# EAGLE design sensor (EAGLE 6.3)
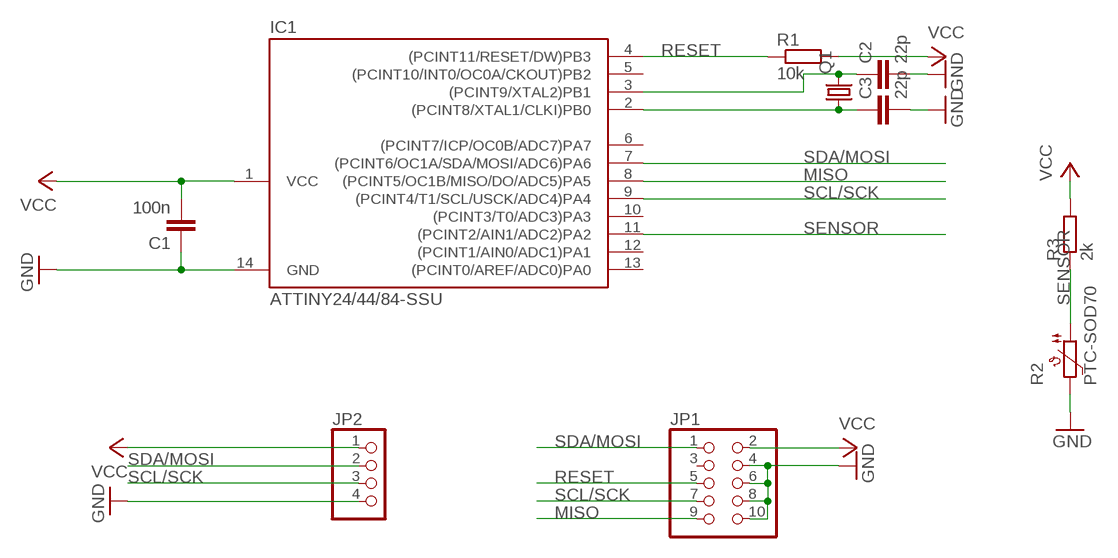
[diagram p0: schematic, sheet 1]

## Parts
C1  100n  C-EUC0805  [C0805]
C2  22p  C-EUC0805  [C0805]
C3  22p  C-EUC0805  [C0805]
IC1  ATTINY24/44/84-SSU  [SOIC14]
JP1  PINHD-2X5  [2X05]
JP2  PINHD-1X4  [1X04]
Q1  CRYSTALHC49UP  [HC49UP]
R1  10k  R-EU_M0805  [M0805]
R2  PTC-SOD70  [SOD70]
R3  2k  R-EU_M0805  [M0805]

## Nets
GND: C1.1 C2.2 C3.2 IC1.14(GND) JP1.4 JP1.6 JP1.8 JP1.10 JP2.4 R2.2
MISO: IC1.8((PCINT5/OC1B/MISO/DO/ADC5)PA5) JP1.9
N$1: C2.1 IC1.3((PCINT9/XTAL2)PB1) Q1.2
N$2: C3.1 IC1.2((PCINT8/XTAL1/CLKI)PB0) Q1.1
RESET: IC1.4((PCINT11/RESET/DW)PB3) JP1.5 R1.1
SCL/SCK: IC1.9((PCINT4/T1/SCL/USCK/ADC4)PA4) JP1.7 JP2.3
SDA/MOSI: IC1.7((PCINT6/OC1A/SDA/MOSI/ADC6)PA6) JP1.1 JP2.2
SENSOR: IC1.11((PCINT2/AIN1/ADC2)PA2) R2.1 R3.1
VCC: C1.2 IC1.1(VCC) JP1.2 JP2.1 R1.2 R3.2
Unconnected: IC1.5((PCINT10/INT0/OC0A/CKOUT)PB2) IC1.6((PCINT7/ICP/OC0B/ADC7)PA7) IC1.10((PCINT3/T0/ADC3)PA3) IC1.12((PCINT1/AIN0/ADC1)PA1) IC1.13((PCINT0/AREF/ADC0)PA0) JP1.3

## Library data of the parts
C1-C3 = rcl:C-EU: CAPACITOR, European symbol
IC1 = attiny24_44_84:ATTINY24/44/84
JP1 = pinhead:PINHD-2X5: PIN HEADER
JP2 = pinhead:PINHD-1X4: PIN HEADER
Q1 = crystal:CRYSTAL: CRYSTAL; OC_FARNELL: unknown; OC_NEWARK: unknown
R1 R3 = rcl:R-EU_: RESISTOR, European symbol
R2 = ptc-ntc:PTC-: Positive Temperature Coefficient Resistor (PTC) termistor Philips KTY81-210 - KTY81-252 Source: 153627-da-01-en-Temperatur-Sensor_KTY10-6_Philips.pdf; OC_FARNELL: unknown; OC_NEWARK: unknown

## Board
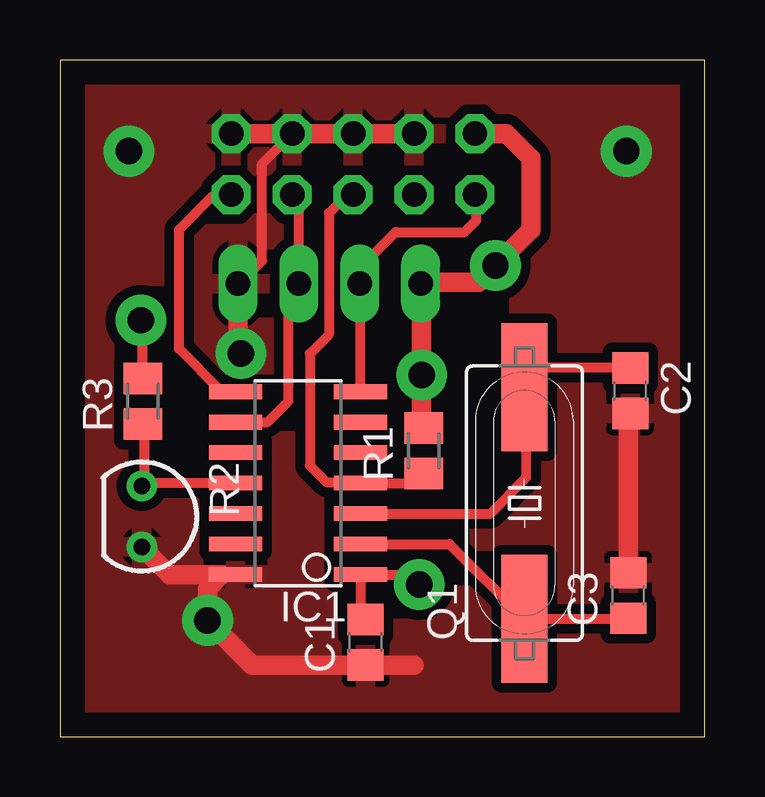
[diagram p1: board, top side]
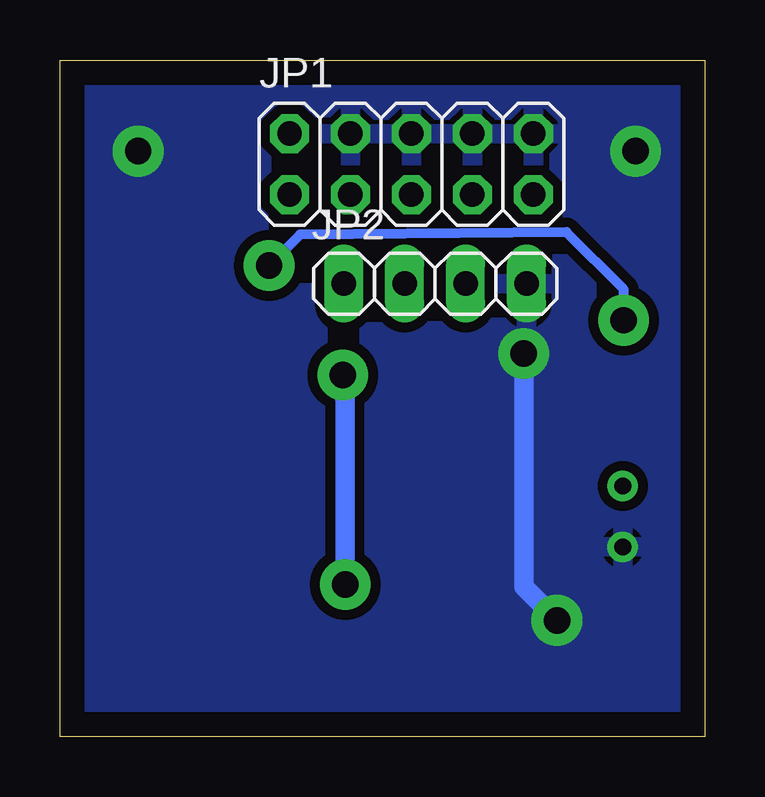
[diagram p2: board, bottom side, seen from below]

Size 26.88 x 28.21 mm. Coordinates in mm from the lower left corner, seen from the top.
Outline: 0,0 26.88,0 26.88,28.21 0,28.21 0,0
Copper layers (1*16): Top 0.035mm / dielectric 1.5mm / Bottom 0.035mm
Design rules "default *": minimum track width 10mil, minimum drill 24mil, track to track 8mil, track to pad 8mil, pad to pad 8mil, via to via 8mil, smd to smd 8mil, copper to edge 40mil, drill to drill 8mil, minimum pad ring 10mil, minimum via ring 8mil, stop-mask expansion 4mil, vias tented up to drill 0mil, thermal gap 10mil

### Footprints (pad centres in the part's own frame; a part is rotated, then mirrored left to right if it is on the bottom)
C0805 = smd 1.3 x 1.5: 1 -0.95,0; 2 0.95,0
SOIC14 = smd 0.61 x 2.21: 1 -3.81,-2.603; 2 -2.54,-2.603; 3 -1.27,-2.603; 4 0,-2.603; 5 1.27,-2.603; 6 2.54,-2.603; 7 3.81,-2.603; 8 3.81,2.603; 9 2.54,2.603; 10 1.27,2.603; 11 0,2.603; 12 -1.27,2.603; 13 -2.54,2.603; 14 -3.81,2.603
2X05 = drill 1.016 octagon: 1 -5.08,-1.27; 2 -5.08,1.27; 3 -2.54,-1.27; 4 -2.54,1.27; 5 0,-1.27; 6 0,1.27; 7 2.54,-1.27; 8 2.54,1.27; 9 5.08,-1.27; 10 5.08,1.27
1X04 = drill 1.016 long: 1 -3.81,0; 2 -1.27,0; 3 1.27,0; 4 3.81,0
HC49UP = smd 5.334 x 1.93: 1 -4.826,0; 2 4.826,0
M0805 = smd 1.3 x 1.6: 1 -0.95,0; 2 0.95,0
SOD70 = drill 0.7 pad 1.27: 1 -1.27,0; 2 1.27,0

### Placement (x,y rotation side)
C1  12.74,3.95 90 top
C2  23.77,14.43 270 top
C3  23.69,5.89 90 top
IC1  9.92,10.58 90 top
JP1  12.22,23.87 0 bottom
JP2  11.23,18.89 0 bottom
Q1  19.37,9.74 90 top
R1  15.16,11.93 90 top
R2  3.41,9.19 270 top
R3  3.45,13.99 90 top

### Tracks (layer width: path | path; a pad name or v marks a point on that pad's centre or on a via)
GND  (via drill 1.1)
  Top 0.406: JP2.4 7.58,18.99 8.43,19.84 8.43,23.89 JP1.8 | IC1.14 6.75,6.77 | 23.69,13.4 C2.2
  Top 0.813: JP1.4 JP1.6 JP1.8 JP1.10 | R2.2 4.56,6.77 6.75,6.77 6.15,6.17 v6.15,4.86 8.01,3 C1.1 14.76,3 | 23.69,13.4 C3.2 | JP2.4 7.42,16.09 v7.54,15.97
  Bottom 0.813: v7.54,15.97 7.54,6.25 v6.15,4.86
  other vias: 23.61,24.41 2.88,24.41
  pour Top (isolate 0.406): -9.82,41.97 55.07,41.97 55.07,-14.39 -19.84,-14.39 -19.84,42.27
  pour Bottom (isolate 0.406): 28.67,32.35 28.67,-6.05 -39.39,-6.05 -39.49,32.54
MISO
  Top 0.406: IC1.8 6.75,14.39 4.96,16.17 4.96,21.13 6.35,22.52 7.06,22.52 JP1.9
N$1
  Top 0.406: IC1.3 17.94,9.31 19.45,10.81 19.45,14.49 Q1.2 20.17,15.38 C2.1
N$2
  Top 0.406: IC1.2 16.25,8.04 Q1.1 23.67,4.92 C3.1
RESET
  Top 0.406: R1.1 14.76,10.58 IC1.4 12.49,10.62 11.11,10.62 10.42,11.31 10.42,15.97 11.21,16.77 11.21,21.83 11.99,22.6 JP1.5
SCL/SCK
  Top 0.406: JP1.7 9.96,22.32 JP2.3 9.53,18.45 9.53,13.99 8.65,13.12 IC1.9
SDA/MOSI
  Top 0.406: JP1.1 17.36,22.56 17.36,21.53 16.87,21.03 13.99,21.03 12.5,19.55 JP2.2 12.5,14.41 IC1.7
SENSOR
  Top 0.406: IC1.11 3.53,10.58 | 3.53,10.58 R2.1 | 3.53,10.58 3.53,12.96 R3.1
VCC  (via drill 1.1)
  Top 0.406: C1.2 12.53,5.11 IC1.1 14.51,6.77 v14.98,6.35 | 15.08,12.96 R1.2 | R3.2 3.45,17.24 v3.37,17.36
  Top 0.813: JP1.2 18.61,25.14 19.65,24.11 19.65,21.13 v18.16,19.65 17.46,18.95 15.08,18.95 | 15.08,18.95 JP2.1 | 15.08,18.95 v15.08,15.08 15.08,12.96
  Bottom 0.406: v3.37,17.36 3.37,18.65 5.75,21.03 16.87,20.93 v18.16,19.65 | 14.98,14.98 v15.08,15.08
  Bottom 0.813: v14.98,6.35 14.98,14.98